# EAGLE board alu3 (EAGLE 7.6.0), part 1 of 2
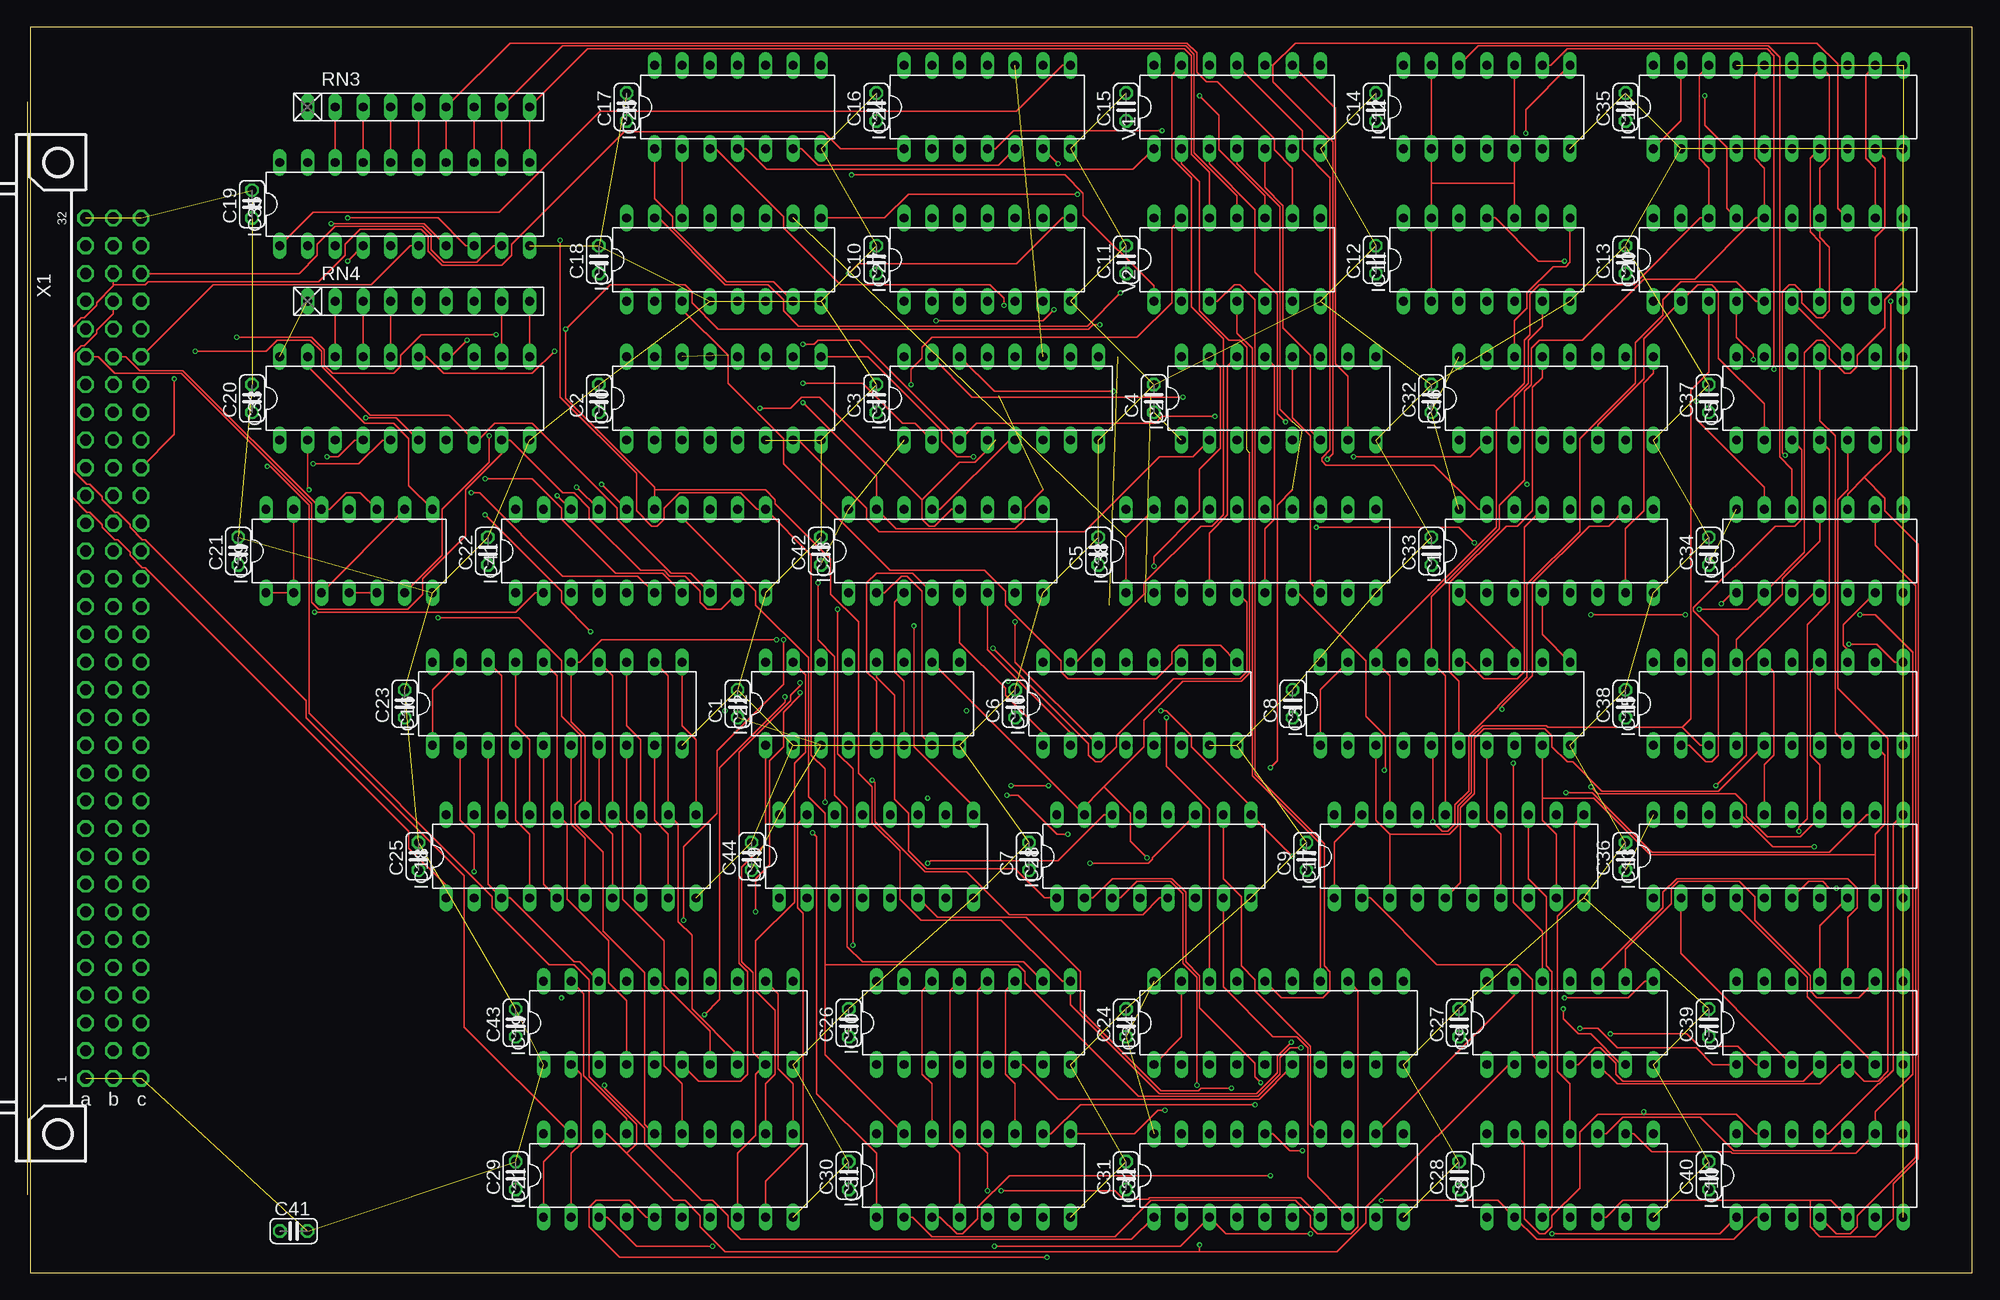
[diagram p5: board, top side]
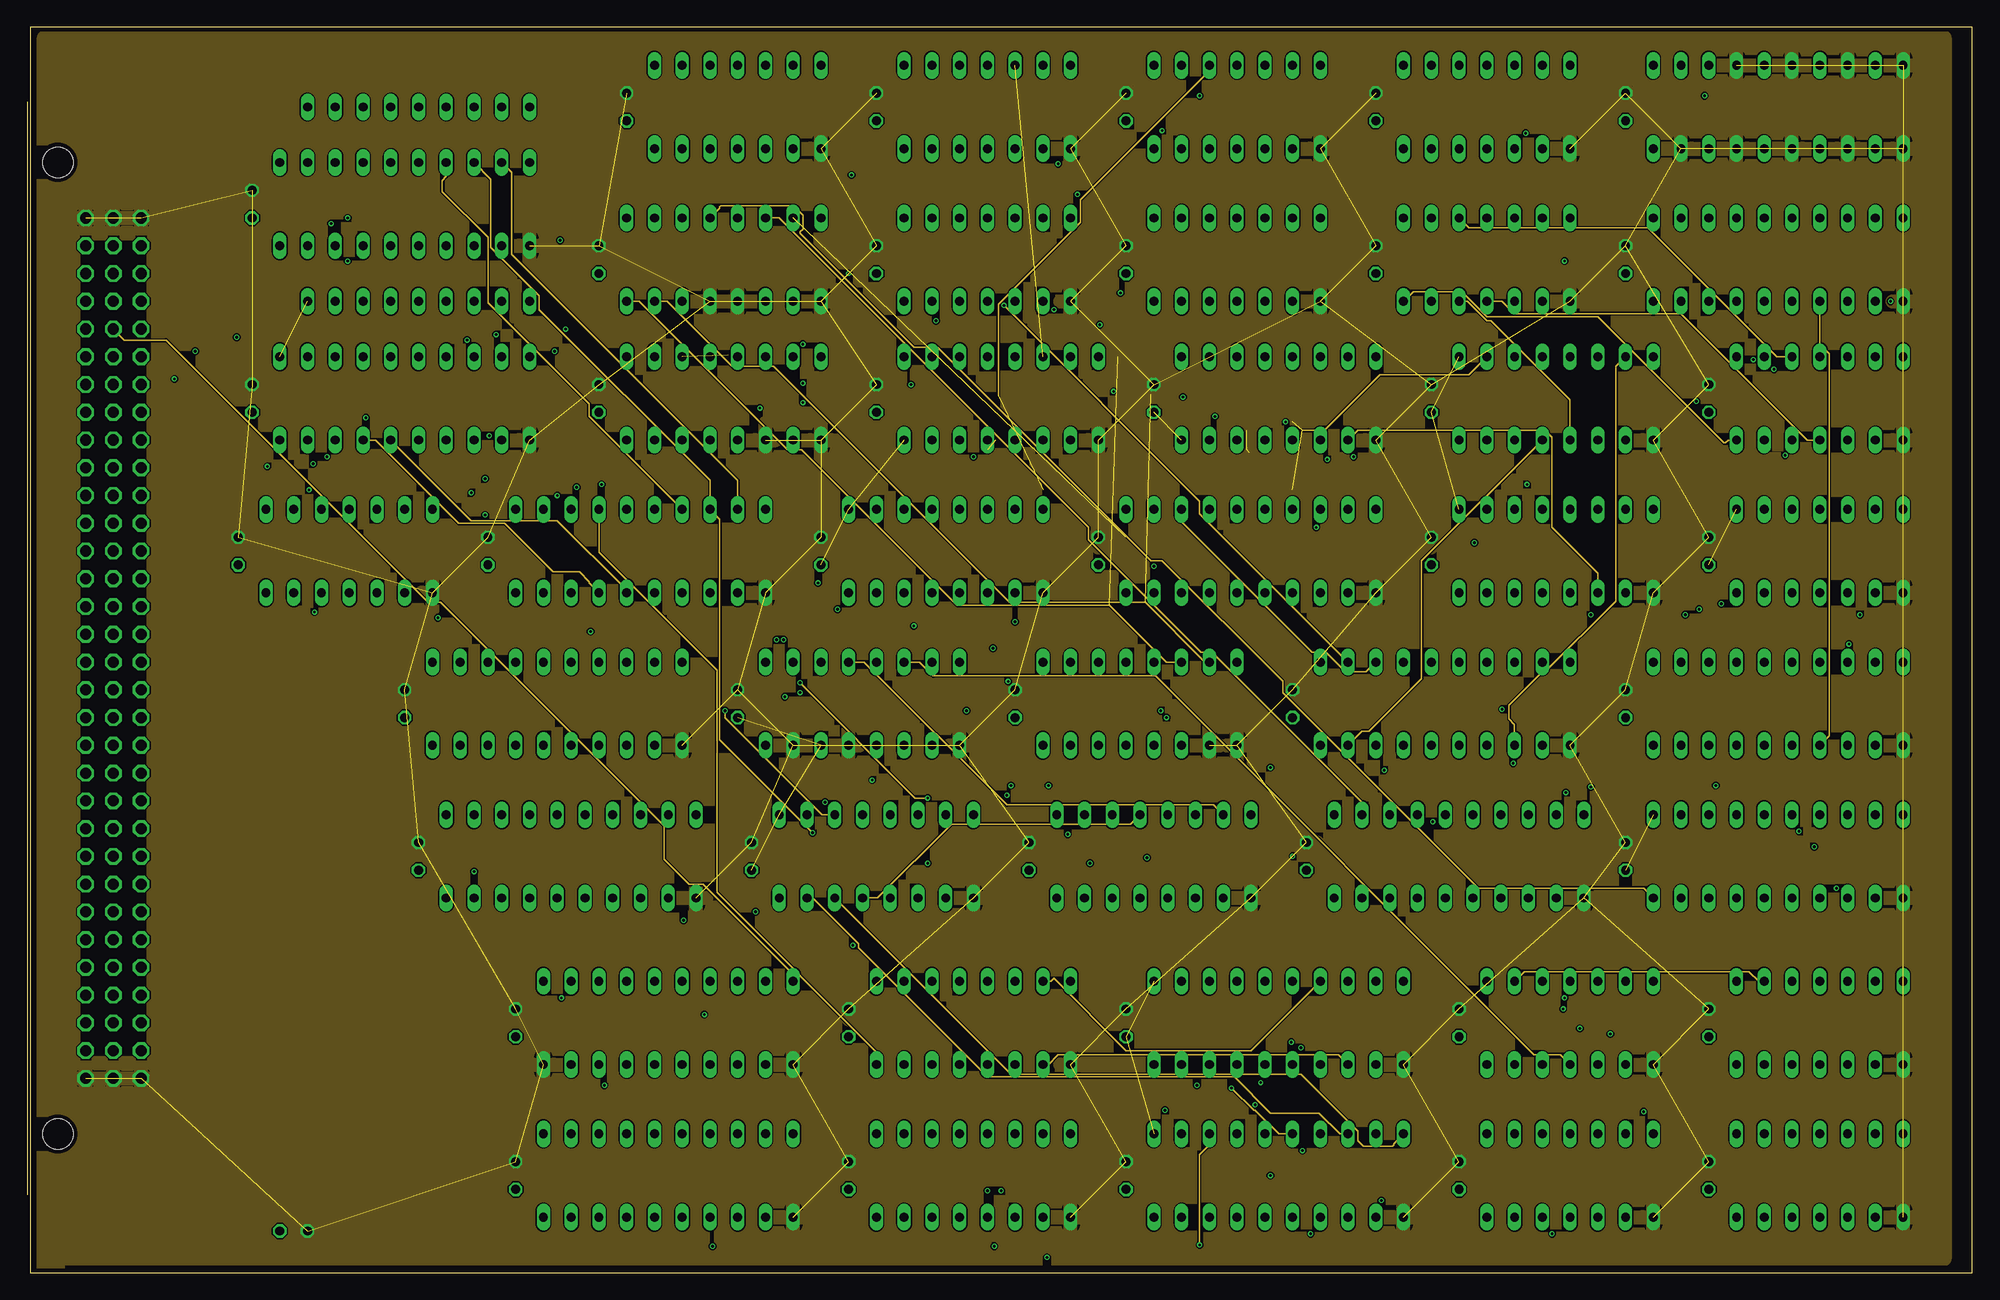
[diagram p6: board, inner layer Route2]
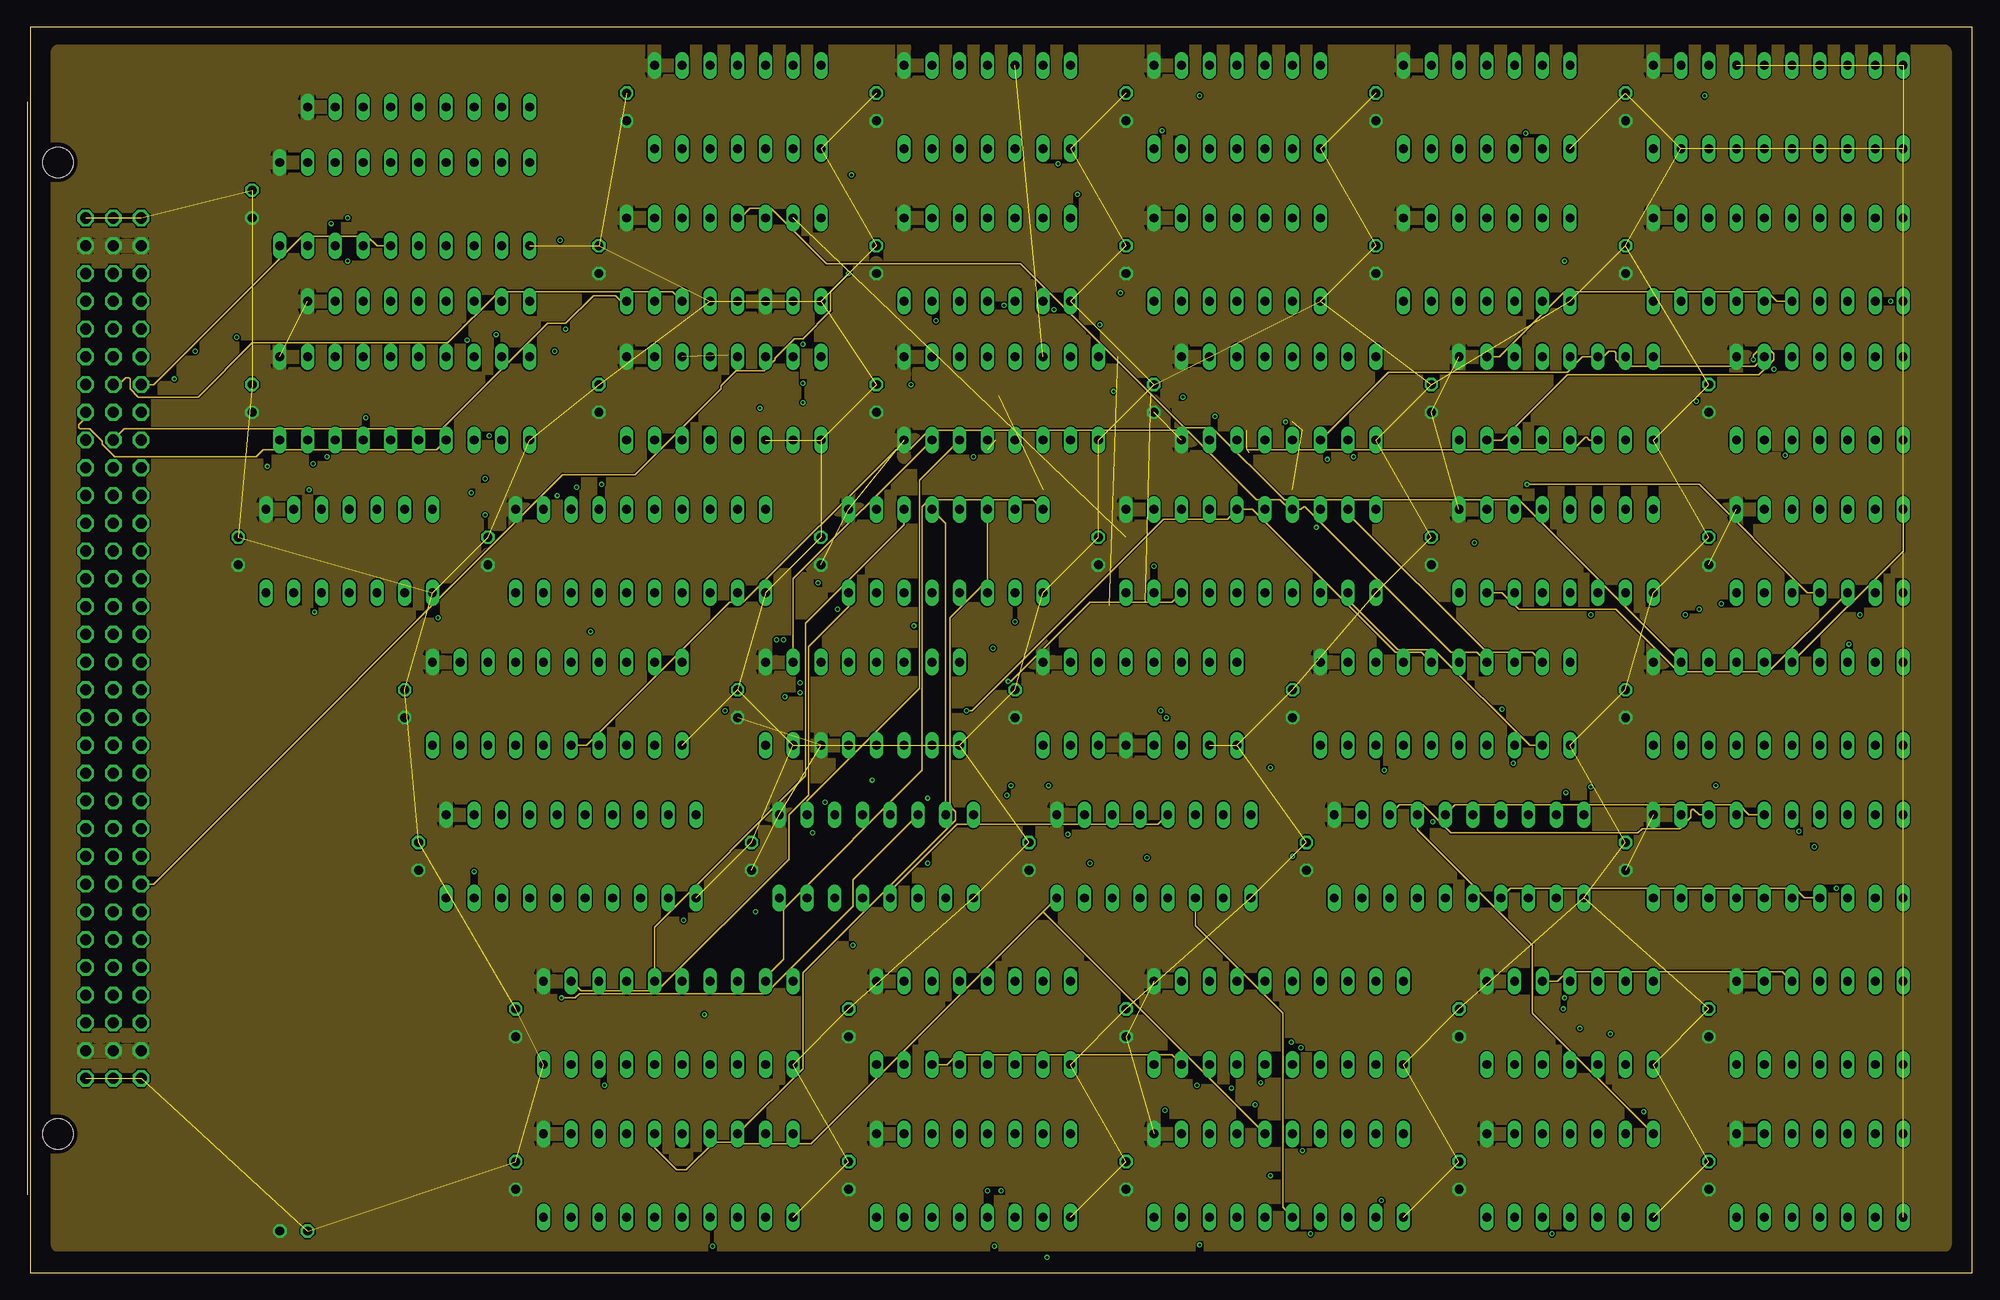
[diagram p7: board, inner layer Route15]
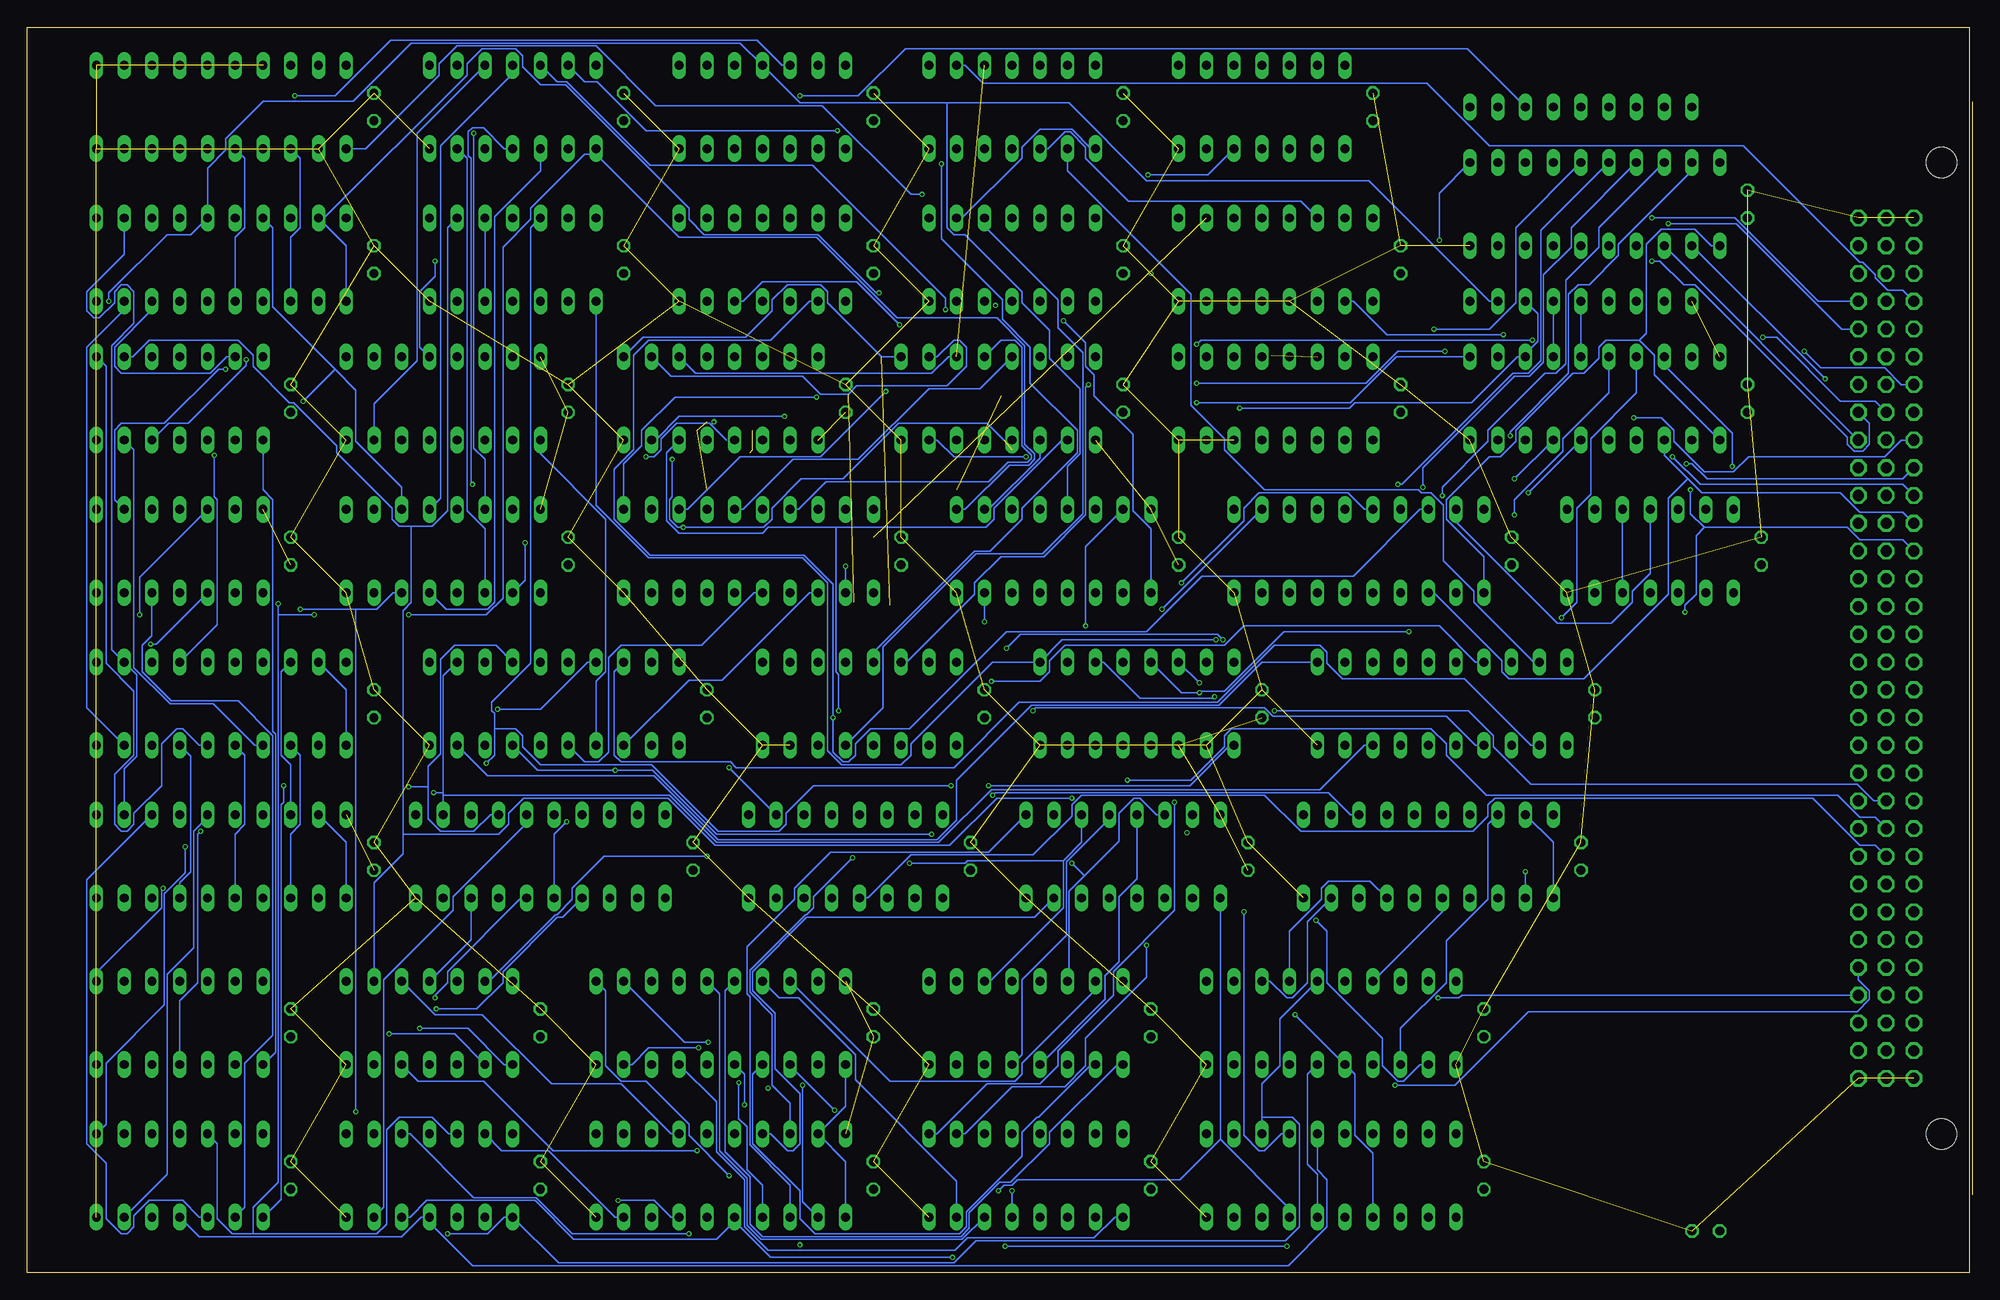
[diagram p8: board, bottom side, seen from below]

Size 177.78 x 113.97 mm. Coordinates in mm from the lower left corner, seen from the top.
Outline: 0,0 177.78,0 177.78,113.97 0,113.97 0,0
Copper layers (1*2*15*16): Top 0.035559375mm / dielectric 0.17018125mm / Route2 0.01778125mm / dielectric 47mil / Route15 0.01778125mm / dielectric 0.17018125mm / Bottom 0.035559375mm
Design rules "OSHPark-4layer": minimum track width 5mil, minimum drill 10mil, track to track 5mil, track to pad 5mil, pad to pad 5mil, via to via 5mil, smd to smd 5mil, copper to edge 15mil, drill to drill 6mil, minimum pad ring 4mil, minimum via ring 4mil, stop-mask expansion 2.5mil, vias tented up to drill 0mil, thermal gap 10mil

## Footprints (pad centres in the part's own frame; a part is rotated, then mirrored left to right if it is on the bottom)
C025-024X044 = drill 0.813 octagon: 1 -1.27,0; 2 1.27,0
DIL16 = drill 0.813 long: 1 -8.89,-3.81; 2 -6.35,-3.81; 3 -3.81,-3.81; 4 -1.27,-3.81; 5 1.27,-3.81; 6 3.81,-3.81; 7 6.35,-3.81; 8 8.89,-3.81; 9 8.89,3.81; 10 6.35,3.81; 11 3.81,3.81; 12 1.27,3.81; 13 -1.27,3.81; 14 -3.81,3.81; 15 -6.35,3.81; 16 -8.89,3.81
DIL20 = drill 0.813 long: 1 -11.43,-3.81; 2 -8.89,-3.81; 3 -6.35,-3.81; 4 -3.81,-3.81; 5 -1.27,-3.81; 6 1.27,-3.81; 7 3.81,-3.81; 8 6.35,-3.81; 9 8.89,-3.81; 10 11.43,-3.81; 11 11.43,3.81; 12 8.89,3.81; 13 6.35,3.81; 14 3.81,3.81; 15 1.27,3.81; 16 -1.27,3.81; 17 -3.81,3.81; 18 -6.35,3.81; 19 -8.89,3.81; 20 -11.43,3.81
DIL14 = drill 0.813 long: 1 -7.62,-3.81; 2 -5.08,-3.81; 3 -2.54,-3.81; 4 0,-3.81; 5 2.54,-3.81; 6 5.08,-3.81; 7 7.62,-3.81; 8 7.62,3.81; 9 5.08,3.81; 10 2.54,3.81; 11 0,3.81; 12 -2.54,3.81; 13 -5.08,3.81; 14 -7.62,3.81
RN-9 = drill 0.813 long: 1 -10.16,0; 2 -7.62,0; 3 -5.08,0; 4 -2.54,0; 5 0,0; 6 2.54,0; 7 5.08,0; 8 7.62,0; 9 10.16,0
FABC96R = drill 1.016 octagon: A1 -2.54,39.37; A2 -2.54,36.83; A3 -2.54,34.29; A4 -2.54,31.75; A5 -2.54,29.21; A6 -2.54,26.67; A7 -2.54,24.13; A8 -2.54,21.59; A9 -2.54,19.05; A10 -2.54,16.51; A11 -2.54,13.97; A12 -2.54,11.43; A13 -2.54,8.89; A14 -2.54,6.35; A15 -2.54,3.81; A16 -2.54,1.27; A17 -2.54,-1.27; A18 -2.54,-3.81; A19 -2.54,-6.35; A20 -2.54,-8.89; A21 -2.54,-11.43; A22 -2.54,-13.97; A23 -2.54,-16.51; A24 -2.54,-19.05; A25 -2.54,-21.59; A26 -2.54,-24.13; A27 -2.54,-26.67; A28 -2.54,-29.21; A29 -2.54,-31.75; A30 -2.54,-34.29; A31 -2.54,-36.83; A32 -2.54,-39.37; B1 -5.08,39.37; B2 -5.08,36.83; B3 -5.08,34.29; B4 -5.08,31.75; B5 -5.08,29.21; B6 -5.08,26.67; B7 -5.08,24.13; B8 -5.08,21.59; B9 -5.08,19.05; B10 -5.08,16.51; B11 -5.08,13.97; B12 -5.08,11.43; B13 -5.08,8.89; B14 -5.08,6.35; B15 -5.08,3.81; B16 -5.08,1.27; B17 -5.08,-1.27; B18 -5.08,-3.81; B19 -5.08,-6.35; B20 -5.08,-8.89; B21 -5.08,-11.43; B22 -5.08,-13.97; B23 -5.08,-16.51; B24 -5.08,-19.05; B25 -5.08,-21.59; B26 -5.08,-24.13; B27 -5.08,-26.67; B28 -5.08,-29.21; B29 -5.08,-31.75; B30 -5.08,-34.29; B31 -5.08,-36.83; B32 -5.08,-39.37; C1 -7.62,39.37; C2 -7.62,36.83; C3 -7.62,34.29; C4 -7.62,31.75; C5 -7.62,29.21; C6 -7.62,26.67; C7 -7.62,24.13; C8 -7.62,21.59; C9 -7.62,19.05; C10 -7.62,16.51; C11 -7.62,13.97; C12 -7.62,11.43; C13 -7.62,8.89; C14 -7.62,6.35; C15 -7.62,3.81; C16 -7.62,1.27; C17 -7.62,-1.27; C18 -7.62,-3.81; C19 -7.62,-6.35; C20 -7.62,-8.89; C21 -7.62,-11.43; C22 -7.62,-13.97; C23 -7.62,-16.51; C24 -7.62,-19.05; C25 -7.62,-21.59; C26 -7.62,-24.13; C27 -7.62,-26.67; C28 -7.62,-29.21; C29 -7.62,-31.75; C30 -7.62,-34.29; C31 -7.62,-36.83; C32 -7.62,-39.37 | hole 2.794: 0,-44.456; 0,44.456

## Placement (x,y rotation side)
C1  [C025-024X044]  64.77,52.07 90 top
C2  [C025-024X044]  52.07,80.01 90 top
C3  [C025-024X044]  77.47,80.01 90 top
C4  [C025-024X044]  102.87,80.01 90 top
C5  [C025-024X044]  97.79,66.04 90 top
C6  [C025-024X044]  90.17,52.07 90 top
C7  [C025-024X044]  91.44,38.1 90 top
C8  [C025-024X044]  115.57,52.07 90 top
C9  [C025-024X044]  116.84,38.1 90 top
C10  [C025-024X044]  77.47,92.71 90 top
C11  [C025-024X044]  100.33,92.71 90 top
C12  [C025-024X044]  123.19,92.71 90 top
C13  [C025-024X044]  146.05,92.71 90 top
C14  [C025-024X044]  123.19,106.68 90 top
C15  [C025-024X044]  100.33,106.68 90 top
C16  [C025-024X044]  77.47,106.68 90 top
C17  [C025-024X044]  54.61,106.68 90 top
C18  [C025-024X044]  52.07,92.71 90 top
C19  [C025-024X044]  20.32,97.79 90 top
C20  [C025-024X044]  20.32,80.01 90 top
C21  [C025-024X044]  19.05,66.04 90 top
C22  [C025-024X044]  41.91,66.04 90 top
C23  [C025-024X044]  34.29,52.07 90 top
C24  [C025-024X044]  100.33,22.86 90 top
C25  [C025-024X044]  35.56,38.1 90 top
C26  [C025-024X044]  74.93,22.86 90 top
C27  [C025-024X044]  130.81,22.86 90 top
C28  [C025-024X044]  130.81,8.89 90 top
C29  [C025-024X044]  44.45,8.89 90 top
C30  [C025-024X044]  74.93,8.89 90 top
C31  [C025-024X044]  100.33,8.89 90 top
C32  [C025-024X044]  128.27,80.01 90 top
C33  [C025-024X044]  128.27,66.04 90 top
C34  [C025-024X044]  153.67,66.04 90 top
C35  [C025-024X044]  146.05,106.68 90 top
C36  [C025-024X044]  146.05,38.1 90 top
C37  [C025-024X044]  153.67,80.01 90 top
C38  [C025-024X044]  146.05,52.07 90 top
C39  [C025-024X044]  153.67,22.86 90 top
C40  [C025-024X044]  153.67,8.89 90 top
C41  [C025-024X044]  24.13,3.81 0 top
C42  [C025-024X044]  72.39,66.04 90 top
C43  [C025-024X044]  44.45,22.86 90 top
C44  [C025-024X044]  66.04,38.1 90 top
IC1  74LS283N  [DIL16]  139.7,66.04 0 top
IC2  74LS194N  [DIL16]  114.3,80.01 0 top
IC3  74LS244N  [DIL20]  129.54,52.07 0 top
IC4  74LS138N  [DIL16]  63.5,92.71 0 top
IC5  74LS32N  [DIL14]  163.83,80.01 0 top
IC6  74LS32N  [DIL14]  163.83,66.04 0 top
IC7  74LS08N  [DIL14]  163.83,22.86 0 top
IC8  74LS86N  [DIL14]  140.97,8.89 0 top
IC9  74LS86N  [DIL14]  140.97,22.86 0 top
IC10  74LS08N  [DIL14]  163.83,8.89 0 top
IC11  74LS86N  [DIL14]  133.35,92.71 0 top
IC12  74LS86N  [DIL14]  133.35,106.68 0 top
IC13  74LS244N  [DIL20]  160.02,38.1 0 top
IC14  74LS244N  [DIL20]  160.02,106.68 0 top
IC15  74LS244N  [DIL20]  160.02,52.07 0 top
IC16  74LS240N  [DIL20]  48.26,52.07 0 top
IC17  74LS244N  [DIL20]  130.81,38.1 0 top
IC18  74LS244N  [DIL20]  49.53,38.1 0 top
IC19  74LS374N  [DIL20]  58.42,22.86 0 top
IC20  74LS244N  [DIL20]  160.02,92.71 0 top
IC21  74LS244N  [DIL20]  58.42,8.89 0 top
IC22  74LS85N  [DIL16]  76.2,52.07 0 top
IC23  74LS85N  [DIL16]  83.82,66.04 0 top
IC24  74ALS04N  [DIL14]  87.63,106.68 0 top
IC25  74LS32N  [DIL14]  64.77,106.68 0 top
IC26  74LS251N  [DIL16]  101.6,52.07 0 top
IC27  74LS86N  [DIL14]  87.63,92.71 0 top
IC28  74LS192N  [DIL16]  102.87,38.1 0 top
IC29  74LS192N  [DIL16]  77.47,38.1 0 top
IC30  74LS192N  [DIL16]  86.36,22.86 0 top
IC31  74LS192N  [DIL16]  86.36,8.89 0 top
IC32  74LS244N  [DIL20]  114.3,8.89 0 top
IC33  74LS245N  [DIL20]  34.29,80.01 0 top
IC34  74LS244N  [DIL20]  114.3,22.86 0 top
IC35  74LS245N  [DIL20]  34.29,97.79 0 top
IC36  74LS283N  [DIL16]  139.7,80.01 0 top
IC37  74LS194N  [DIL16]  88.9,80.01 0 top
IC38  74LS244N  [DIL20]  111.76,66.04 0 top
IC39  74LS00N  [DIL14]  29.21,66.04 0 top
IC40  74LS153N  [DIL16]  63.5,80.01 0 top
IC41  74LS245N  [DIL20]  55.88,66.04 0 top
RN3  10k  [RN-9]  35.56,106.68 0 top
RN4  10k  [RN-9]  35.56,88.9 0 top
V1  744078N  [DIL14]  110.49,106.68 0 top
V2  744078N  [DIL14]  110.49,92.71 0 top
X1  FABC96R  [FABC96R]  2.54,57.15 180 top